# EAGLE schematic ATmega328P (EAGLE 7.5.0)
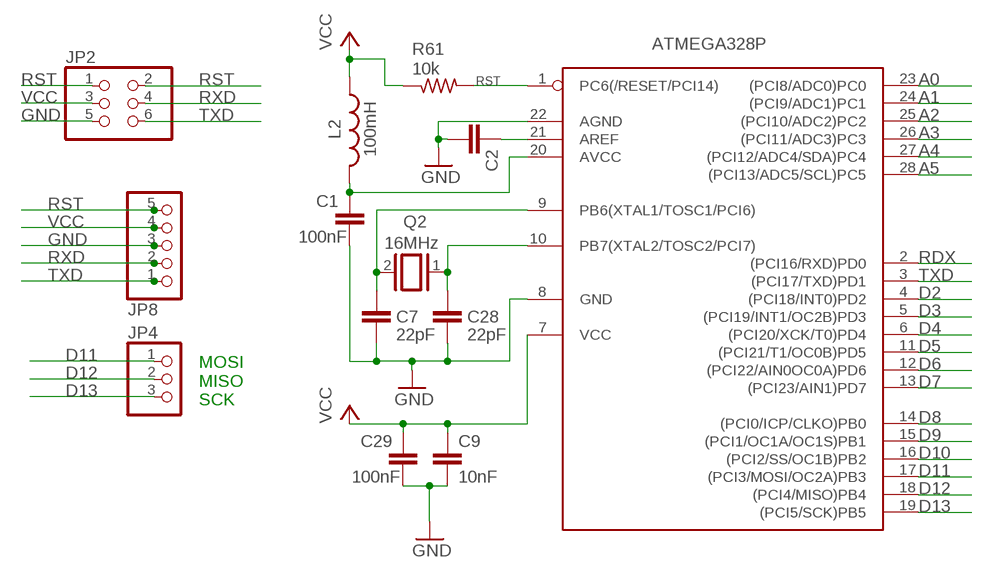
[diagram p0: schematic, sheet 1]

## Parts
C1  100nF  C-EU050-024X044  [C050-024X044]
C2  C-EU050-024X044  [C050-024X044]
C7  22pF  C-EU050-024X044  [C050-024X044]
C9  10nF  C-EU050-024X044  [C050-024X044]
C28  22pF  C-EU050-024X044  [C050-024X044]
C29  100nF  C-EU050-024X044  [C050-024X044]
IC7  ATMEGA328P  ATMEGA168-20P  [DIL28-3]
JP2  PINHD-2X3  [2X03]
JP4  PINHD-1X3  [1X03]
JP8  PINHD-1X5/90  [1X05/90]
L2  100mH  L-US0207/10  [0207/10]
Q2  16MHz  XTAL/S  [QS]
R61  10k  R-US_0204/7  [0204/7]

## Nets
A0: IC7.23((PCI8/ADC0)PC0)
A1: IC7.24((PCI9/ADC1)PC1)
A2: IC7.25((PCI10/ADC2)PC2)
A3: IC7.26((PCI11/ADC3)PC3)
A4: IC7.27((PCI12/ADC4/SDA)PC4)
A5: IC7.28((PCI13/ADC5/SCL)PC5)
D2: IC7.4((PCI18/INT0)PD2)
D3: IC7.5((PCI19/INT1/OC2B)PD3)
D4: IC7.6((PCI20/XCK/T0)PD4)
D5: IC7.11((PCI21/T1/OC0B)PD5)
D6: IC7.12((PCI22/AIN0OC0A)PD6)
D7: IC7.13((PCI23/AIN1)PD7)
D8: IC7.14((PCI0/ICP/CLKO)PB0)
D9: IC7.15((PCI1/OC1A/OC1S)PB1)
D10: IC7.16((PCI2/SS/OC1B)PB2)
D11: IC7.17((PCI3/MOSI/OC2A)PB3) JP4.1
D12: IC7.18((PCI4/MISO)PB4) JP4.2
D13: IC7.19((PCI5/SCK)PB5) JP4.3
GND: C1.2 C2.2 C7.2 C9.2 C28.2 C29.2 IC7.8(GND) IC7.22(AGND) JP2.5 JP8.3
N$4: C1.1 IC7.20(AVCC) L2.2
N$21: C28.1 IC7.10(PB7(XTAL2/TOSC2/PCI7)) Q2.1
N$22: C7.1 IC7.9(PB6(XTAL1/TOSC1/PCI6)) Q2.2
N$65: C2.1 IC7.21(AREF)
RDX: IC7.2((PCI16/RXD)PD0)
RST: IC7.1(PC6(/RESET/PCI14)) JP2.1 JP2.2 JP8.5 R61.2
RXD: JP2.4 JP8.2
TXD: IC7.3((PCI17/TXD)PD1) JP2.6 JP8.1
VCC: C9.1 C29.1 IC7.7(VCC) JP2.3 JP8.4 L2.1 R61.1

## Notes on the sheet
- MOSI
  MISO
  SCK

## Library data of the parts
C1 C2 C7 C9 C28 C29 = rcl:C-EU: CAPACITOR, European symbol
IC7 = adafruit:ATMEGA168*P: MICROCONTROLLER 16 kBytes FLASH 1 kBytes SRAM 512 Bytes EEPROM USART 8-channel 10 bit ADC
JP2 = pinhead:PINHD-2X3: PIN HEADER
JP4 = adafruit:PINHD-1X3: PIN HEADER
JP8 = pinhead:PINHD-1X5: PIN HEADER
L2 = rcl:L-US: INDUCTOR, American symbol
Q2 = special:XTAL/S: CRYSTAL
R61 = adafruit:R-US_: RESISTOR, American symbol